# Altium schematic sheet gma245.SchDoc
size A; SheetNumber: 16; SheetTotal: 17
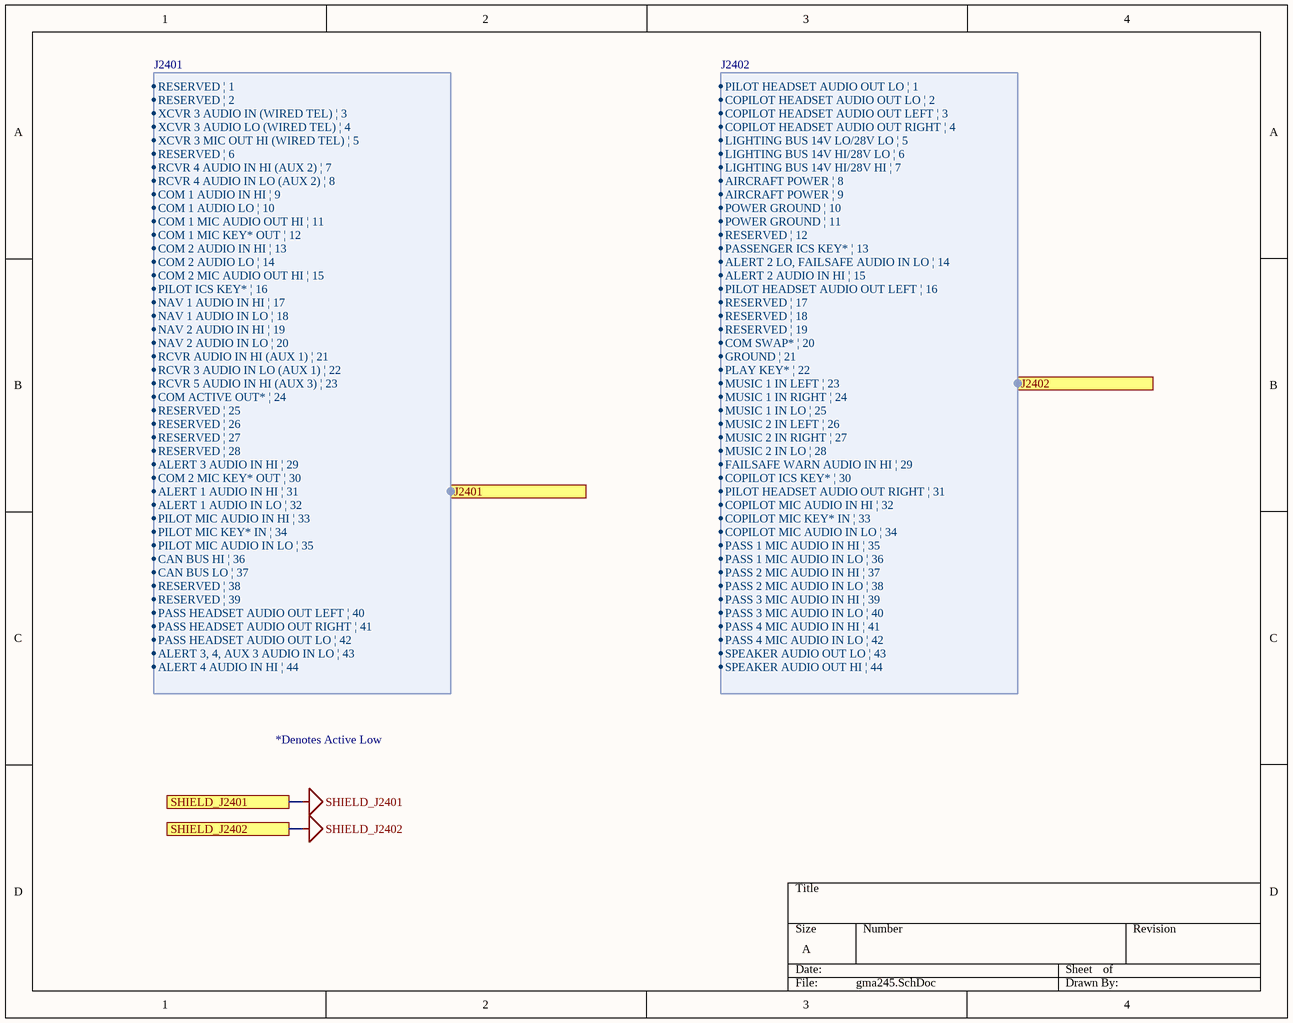
[diagram p0: gma245.SchDoc]

## Ports
J2401 (harness J2401), J2402 (harness J2402), SHIELD_J2401, SHIELD_J2402

## Harnesses
J2401: RESERVED | 1, RESERVED | 2, XCVR 3 AUDIO IN (WIRED TEL) | 3, XCVR 3 AUDIO LO (WIRED TEL) | 4, XCVR 3 MIC OUT HI (WIRED TEL) | 5, RESERVED | 6, RCVR 4 AUDIO IN HI (AUX 2) | 7, RCVR 4 AUDIO IN LO (AUX 2) | 8, COM 1 AUDIO IN HI | 9, COM 1 AUDIO LO | 10, COM 1 MIC AUDIO OUT HI | 11, COM 1 MIC KEY* OUT | 12, COM 2 AUDIO IN HI | 13, COM 2 AUDIO LO | 14, COM 2 MIC AUDIO OUT HI | 15, PILOT ICS KEY* | 16, NAV 1 AUDIO IN HI | 17, NAV 1 AUDIO IN LO | 18, NAV 2 AUDIO IN HI | 19, NAV 2 AUDIO IN LO | 20, RCVR AUDIO IN HI (AUX 1) | 21, RCVR 3 AUDIO IN LO (AUX 1) | 22, RCVR 5 AUDIO IN HI (AUX 3) | 23, COM ACTIVE OUT* | 24, RESERVED | 25, RESERVED | 26, RESERVED | 27, RESERVED | 28, ALERT 3 AUDIO IN HI | 29, COM 2 MIC KEY* OUT | 30, ALERT 1 AUDIO IN HI | 31, ALERT 1 AUDIO IN LO | 32, PILOT MIC AUDIO IN HI | 33, PILOT MIC KEY* IN | 34, PILOT MIC AUDIO IN LO | 35, CAN BUS HI | 36, CAN BUS LO | 37, RESERVED | 38, RESERVED | 39, PASS HEADSET AUDIO OUT LEFT | 40, PASS HEADSET AUDIO OUT RIGHT | 41, PASS HEADSET AUDIO OUT LO | 42, ALERT 3, 4, AUX 3 AUDIO IN LO | 43, ALERT 4 AUDIO IN HI | 44
J2402: PILOT HEADSET AUDIO OUT LO | 1, COPILOT HEADSET AUDIO OUT LO | 2, COPILOT HEADSET AUDIO OUT LEFT | 3, COPILOT HEADSET AUDIO OUT RIGHT | 4, LIGHTING BUS 14V LO/28V LO | 5, LIGHTING BUS 14V HI/28V LO | 6, LIGHTING BUS 14V HI/28V HI | 7, AIRCRAFT POWER | 8, AIRCRAFT POWER | 9, POWER GROUND | 10, POWER GROUND | 11, RESERVED | 12, PASSENGER ICS KEY* | 13, ALERT 2 LO, FAILSAFE AUDIO IN LO | 14, ALERT 2 AUDIO IN HI | 15, PILOT HEADSET AUDIO OUT LEFT | 16, RESERVED | 17, RESERVED | 18, RESERVED | 19, COM SWAP* | 20, GROUND | 21, PLAY KEY* | 22, MUSIC 1 IN LEFT | 23, MUSIC 1 IN RIGHT | 24, MUSIC 1 IN LO | 25, MUSIC 2 IN LEFT | 26, MUSIC 2 IN RIGHT | 27, MUSIC 2 IN LO | 28, FAILSAFE WARN AUDIO IN HI | 29, COPILOT ICS KEY* | 30, PILOT HEADSET AUDIO OUT RIGHT | 31, COPILOT MIC AUDIO IN HI | 32, COPILOT MIC KEY* IN | 33, COPILOT MIC AUDIO IN LO | 34, PASS 1 MIC AUDIO IN HI | 35, PASS 1 MIC AUDIO IN LO | 36, PASS 2 MIC AUDIO IN HI | 37, PASS 2 MIC AUDIO IN LO | 38, PASS 3 MIC AUDIO IN HI | 39, PASS 3 MIC AUDIO IN LO | 40, PASS 4 MIC AUDIO IN HI | 41, PASS 4 MIC AUDIO IN LO | 42, SPEAKER AUDIO OUT LO | 43, SPEAKER AUDIO OUT HI | 44

## Nets
SHIELD_J2401: port SHIELD_J2401
SHIELD_J2402: port SHIELD_J2402

## Notes on the sheet
- *Denotes Active Low